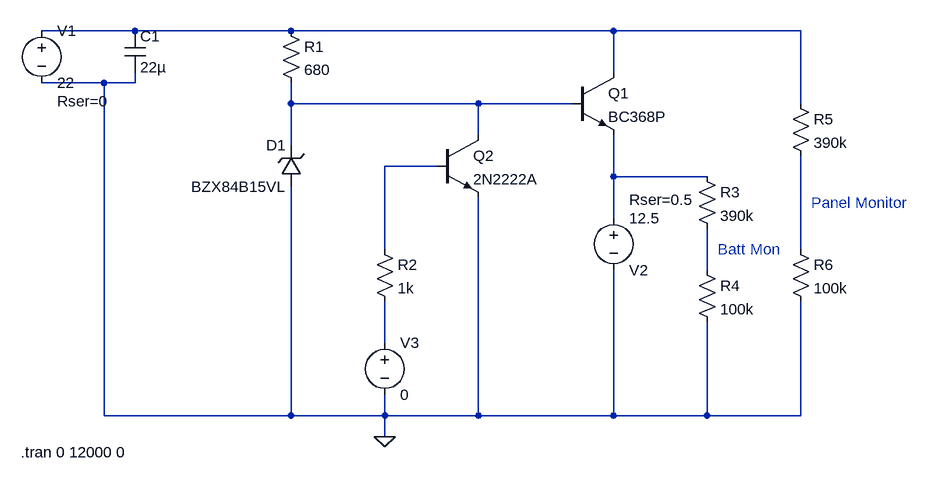
[diagram p0: schematic Charging Circuit.asc]
Charging Circuit.asc, the LTspice schematic file:
Version 4
SHEET 1 1428 800
WIRE 224 80 80 80
WIRE 464 80 224 80
WIRE 960 80 464 80
WIRE 1248 80 960 80
WIRE 960 144 960 80
WIRE 176 160 80 160
WIRE 224 160 224 144
WIRE 224 160 176 160
WIRE 464 192 464 160
WIRE 752 192 464 192
WIRE 896 192 752 192
WIRE 1248 192 1248 80
WIRE 752 240 752 192
WIRE 464 256 464 192
WIRE 688 288 608 288
WIRE 960 304 960 240
WIRE 1104 304 960 304
WIRE 960 368 960 304
WIRE 608 416 608 288
WIRE 1248 416 1248 272
WIRE 1104 448 1104 384
WIRE 608 560 608 496
WIRE 176 672 176 160
WIRE 464 672 464 320
WIRE 464 672 176 672
WIRE 608 672 608 640
WIRE 608 672 464 672
WIRE 752 672 752 336
WIRE 752 672 608 672
WIRE 960 672 960 448
WIRE 960 672 752 672
WIRE 1104 672 1104 528
WIRE 1104 672 960 672
WIRE 1248 672 1248 496
WIRE 1248 672 1104 672
WIRE 608 704 608 672
FLAG 608 704 0
SYMBOL voltage 80 64 R0
WINDOW 123 0 0 Left 0
WINDOW 39 24 124 Left 2
SYMATTR SpiceLine Rser=0
SYMATTR InstName V1
SYMATTR Value 22
SYMBOL cap 208 80 R0
SYMATTR InstName C1
SYMATTR Value 22µ
SYMATTR SpiceLine V=50
SYMBOL res 448 64 R0
SYMATTR InstName R1
SYMATTR Value 680
SYMBOL zener 480 320 R180
WINDOW 0 24 64 Left 2
WINDOW 3 24 0 Left 2
SYMATTR InstName D1
SYMATTR Value BZX84B15VL
SYMBOL npn 896 144 R0
SYMATTR InstName Q1
SYMATTR Value BC368P
SYMBOL voltage 960 352 R0
WINDOW 0 24 96 Left 2
WINDOW 3 24 16 Left 2
WINDOW 123 0 0 Left 0
WINDOW 39 24 -12 Left 2
SYMATTR InstName V2
SYMATTR Value 12.5
SYMATTR SpiceLine Rser=0.5
SYMBOL npn 688 240 R0
SYMATTR InstName Q2
SYMATTR Value 2N2222A
SYMBOL res 592 400 R0
SYMATTR InstName R2
SYMATTR Value 1k
SYMBOL voltage 608 544 R0
WINDOW 123 0 0 Left 0
WINDOW 39 0 0 Left 0
SYMATTR InstName V3
SYMATTR Value 0
SYMBOL res 1088 288 R0
SYMATTR InstName R3
SYMATTR Value 390k
SYMBOL res 1088 432 R0
SYMATTR InstName R4
SYMATTR Value 100k
SYMBOL res 1232 176 R0
SYMATTR InstName R5
SYMATTR Value 390k
SYMBOL res 1232 400 R0
SYMATTR InstName R6
SYMATTR Value 100k
TEXT 48 728 Left 2 !.tran 0 12000 0
TEXT 1264 344 Left 2 ;Panel Monitor
TEXT 1120 416 Left 2 ;Batt Mon

The netlist it stands for:
* Charging Circuit.asc
V1 N001 0 22 Rser=0
C1 N001 0 22µ V=50
R1 N001 N002 680
D1 0 N002 BZX84B15VL
Q1 N001 N002 N004 0 BC368P
V2 N004 0 12.5 Rser=0.5
Q2 N002 N003 0 0 2N2222A
R2 N003 N007 1k
V3 N007 0 0
R3 N004 N006 390k
R4 N006 0 100k
R5 N001 N005 390k
R6 N005 0 100k
.model D D
.lib standard.dio
.model NPN NPN
.model PNP PNP
.lib standard.bjt
.tran 0 12000 0
* Panel Monitor
* Batt Mon
.backanno
.end